# EAGLE design DoubleWing_Blank (EAGLE 9.4.2)
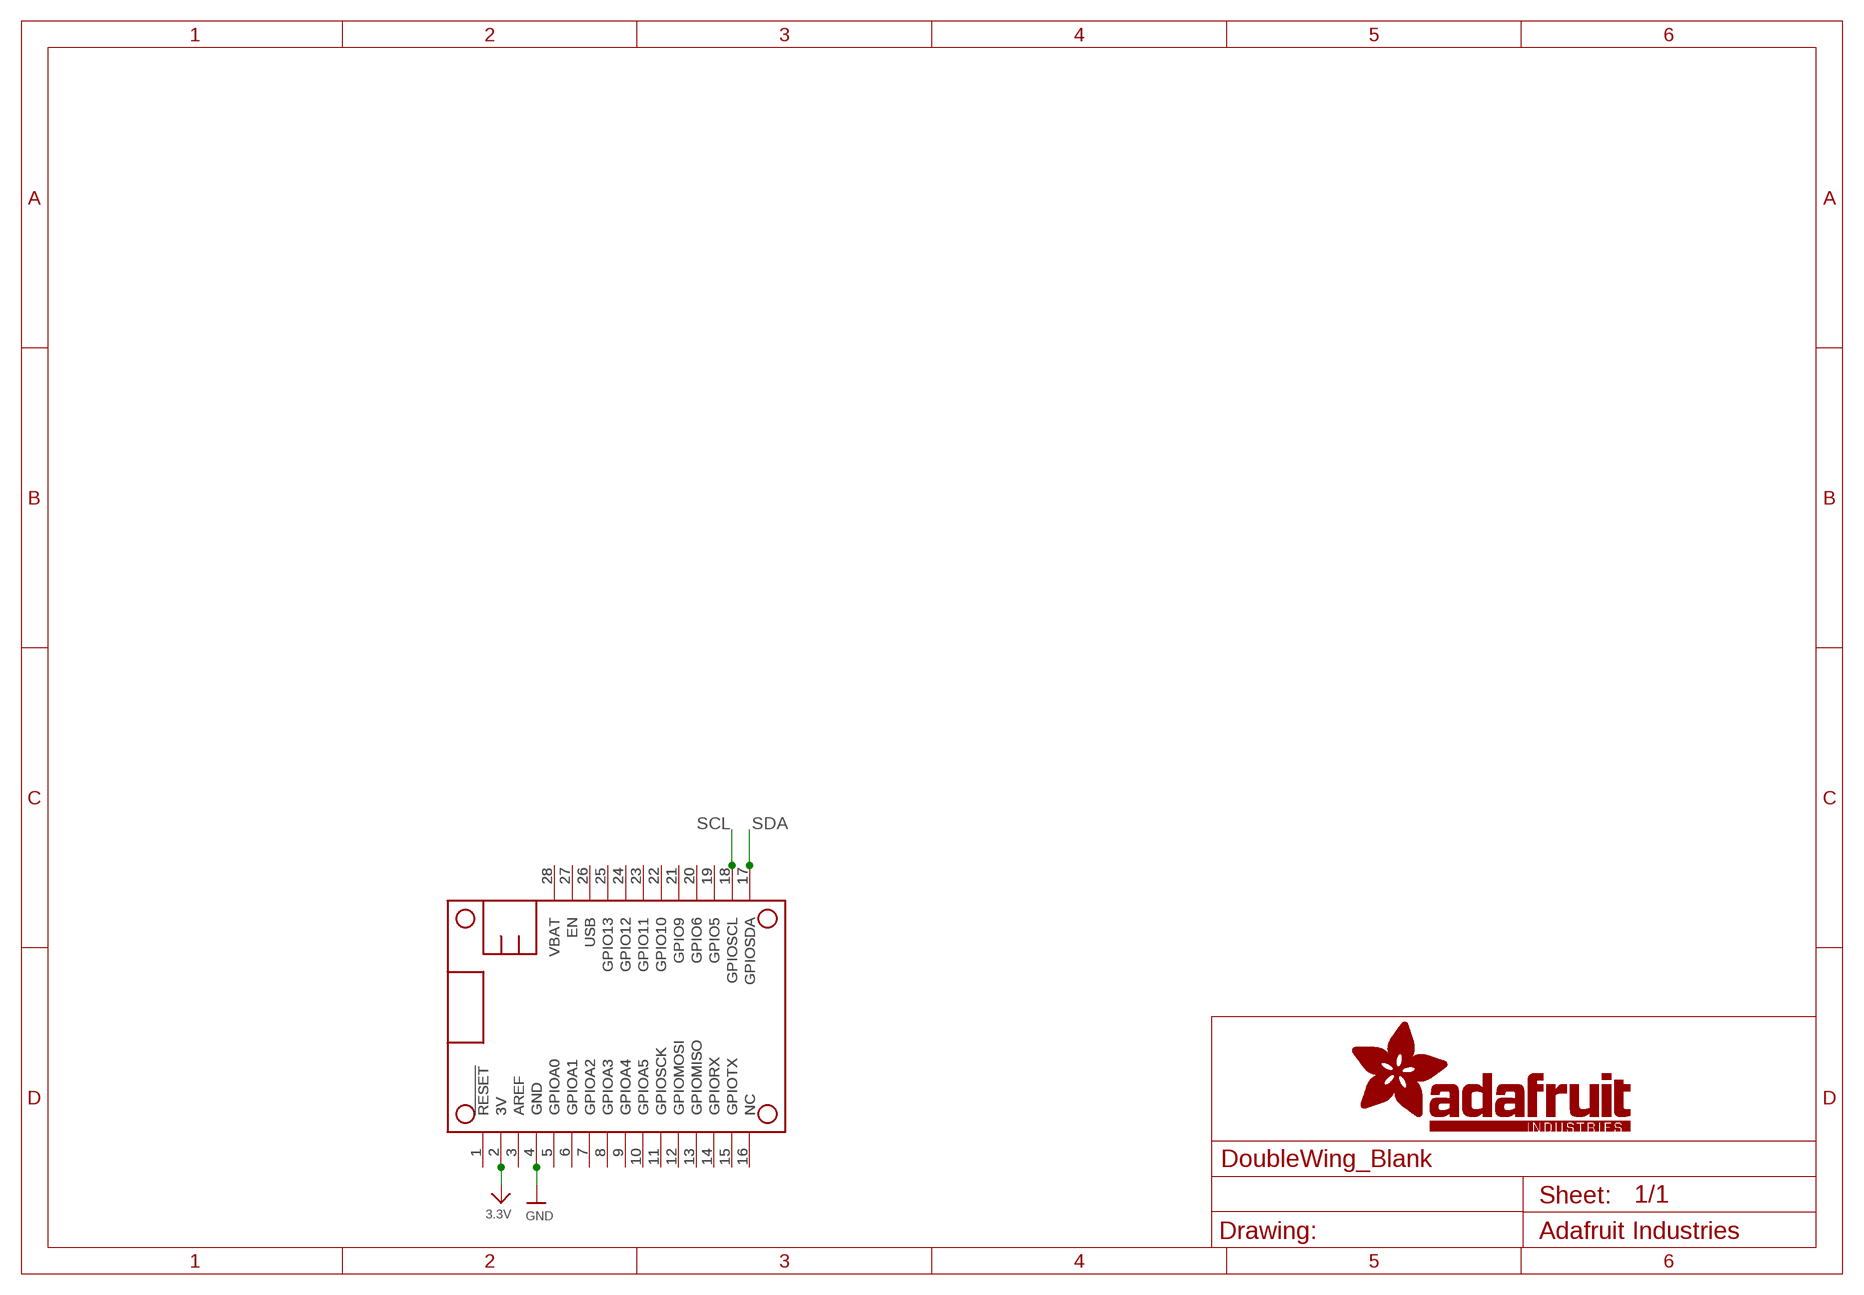
[diagram p0: schematic, sheet 1]

## Parts
MS1  FEATHERWING_NODIM  [FEATHERWING_DIM]
MS2  FEATHERWING_NODIM  [FEATHERWING_DIM]

## Nets
3.3V: MS1.2(3V) MS2.2(3V)
GND: MS1.4(GND) MS2.4(GND)
N$1: MS1.27(EN) MS2.27(EN)
N$2: MS1.16(NC) MS2.16(NC)
N$3: MS1.25(GPIO13) MS2.25(GPIO13)
N$4: MS1.15(GPIOTX) MS2.15(GPIOTX)
N$5: MS1.24(GPIO12) MS2.24(GPIO12)
N$6: MS1.14(GPIORX) MS2.14(GPIORX)
N$7: MS1.13(GPIOMISO) MS2.13(GPIOMISO)
N$8: MS1.12(GPIOMOSI) MS2.12(GPIOMOSI)
N$9: MS1.11(GPIOSCK) MS2.11(GPIOSCK)
N$10: MS1.10(GPIOA5) MS2.10(GPIOA5)
N$11: MS1.9(GPIOA4) MS2.9(GPIOA4)
N$12: MS1.8(GPIOA3) MS2.8(GPIOA3)
N$13: MS1.7(GPIOA2) MS2.7(GPIOA2)
N$14: MS1.6(GPIOA1) MS2.6(GPIOA1)
N$15: MS1.5(GPIOA0) MS2.5(GPIOA0)
N$17: MS1.3(AREF) MS2.3(AREF)
N$18: MS1.1(!RESET) MS2.1(!RESET)
N$19: MS1.23(GPIO11) MS2.23(GPIO11)
N$20: MS1.22(GPIO10) MS2.22(GPIO10)
N$21: MS1.21(GPIO9) MS2.21(GPIO9)
N$22: MS1.20(GPIO6) MS2.20(GPIO6)
N$23: MS1.19(GPIO5) MS2.19(GPIO5)
SCL: MS1.18(GPIOSCL) MS2.18(GPIOSCL)
SDA: MS1.17(GPIOSDA) MS2.17(GPIOSDA)
USB: MS1.26(USB) MS2.26(USB)
VBAT: MS1.28(VBAT) MS2.28(VBAT)

## Library data of the parts
MS1 MS2 = microbuilder:FEATHERWING

## Board
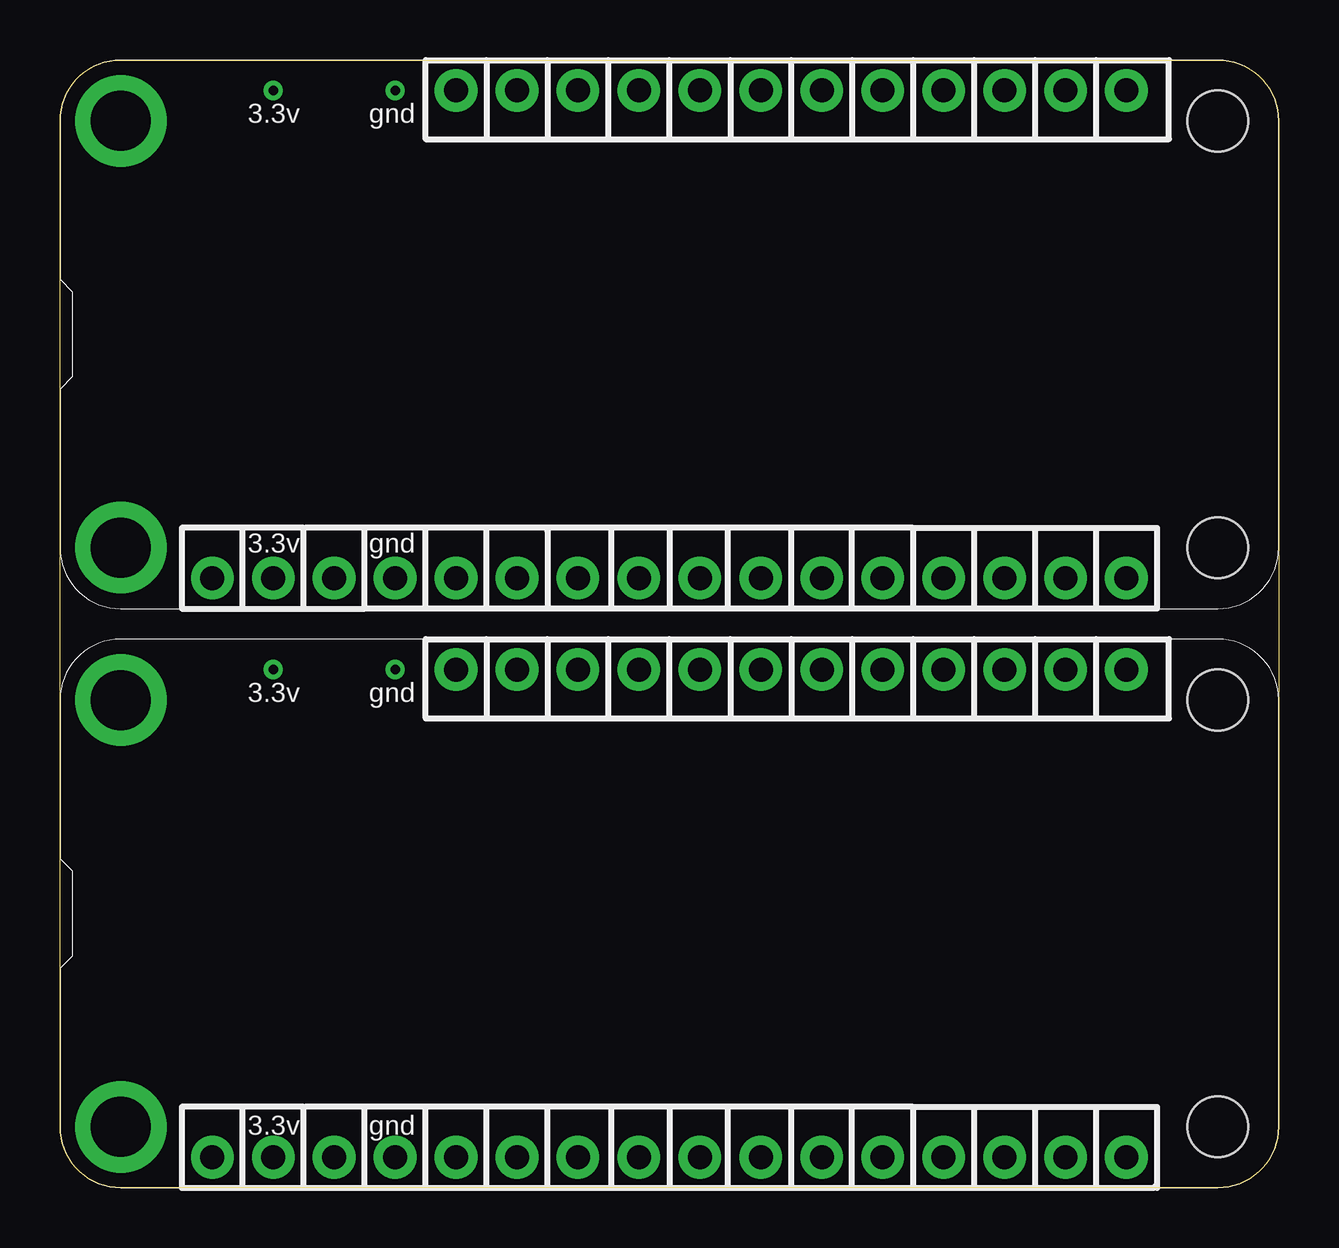
[diagram p1: board, top side]
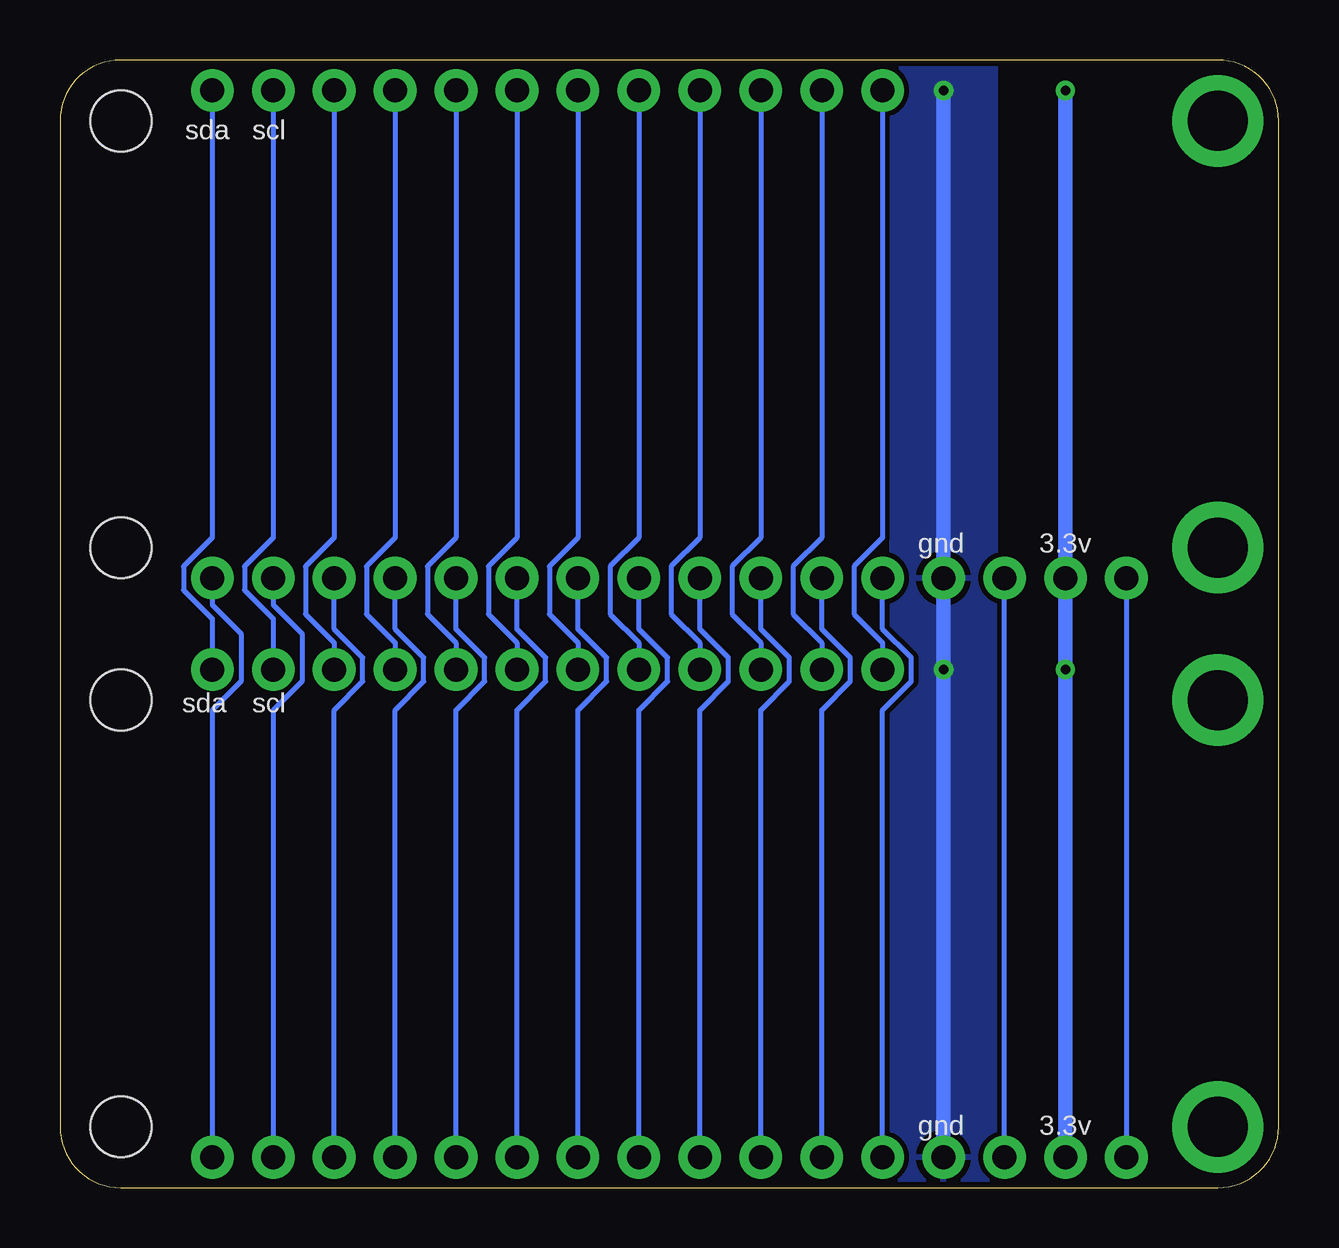
[diagram p2: board, bottom side, seen from below]

Size 50.8 x 46.99 mm. Coordinates in mm from the lower left corner, seen from the top.
Outline: 2.54,46.99 48.26,46.99 arc-90 50.8,44.45 50.8,2.54 arc-90 48.26,0 2.54,0 arc-90 0,2.54 0,44.45 arc-90 2.54,46.99
Copper layers (1*16): Top 0.035mm / dielectric 1.5mm / Bottom 0.035mm
Design rules "adafruit": minimum track width 8mil, minimum drill 15.5mil, track to track 8mil, track to pad 8mil, pad to pad 8mil, via to via 8mil, smd to smd 8mil, copper to edge 10mil, drill to drill 8mil, minimum pad ring 10mil, minimum via ring 8mil, stop-mask expansion 2mil, vias tented up to drill 20mil, thermal gap 10mil

### Footprints (pad centres in the part's own frame; a part is rotated, then mirrored left to right if it is on the bottom)
FEATHERWING_DIM = drill 1 pad 1.778: 1 6.35,1.27; 2 8.89,1.27; 3 11.43,1.27; 4 13.97,1.27; 5 16.51,1.27; 6 19.05,1.27; 7 21.59,1.27; 8 24.13,1.27; 9 26.67,1.27; 10 29.21,1.27; 11 31.75,1.27; 12 34.29,1.27; 13 36.83,1.27; 14 39.37,1.27; 15 41.91,1.27; 16 44.45,1.27; 17 44.45,21.59; 18 41.91,21.59; 19 39.37,21.59; 20 36.83,21.59; 21 34.29,21.59; 22 31.75,21.59; 23 29.21,21.59; 24 26.67,21.59; 25 24.13,21.59; 26 21.59,21.59; 27 19.05,21.59; 28 16.51,21.59 | drill 2.5 pad 3.81: P$1 2.54,20.32; P$2 2.54,2.54 | hole 2.54: 48.26,20.32; 48.26,2.54

### Placement (x,y rotation side)
MS1  0,0 0 top
MS2  0,24.13 0 top

### Tracks (layer width: path | path; a pad name or v marks a point on that pad's centre or on a via)
3.3V  (via drill 0.39)
  Bottom 0.61: v8.89,45.72 MS2.2 v8.89,21.59 MS1.2
GND  (via drill 0.39)
  Bottom 0.61: v13.97,45.72 MS2.4 v13.97,21.59 MS1.4
  pour Bottom: 16.13,46.74 11.81,46.74 11.81,0.25 16.13,0.25
N$1
  Bottom 0.203: MS1.27 19.05,22.7 20.24,23.9 20.24,25.89 19.05,27.09 MS2.27
N$2
  Bottom 0.203: MS2.16 44.45,24.29 43.26,23.09 43.26,21.1 44.45,19.9 MS1.16
N$3
  Bottom 0.203: MS1.25 24.13,22.7 25.32,23.9 25.32,25.89 24.13,27.09 MS2.25
N$4
  Bottom 0.203: MS2.15 41.91,24.29 40.72,23.09 40.72,21.1 41.91,19.9 MS1.15
N$5
  Bottom 0.203: MS1.24 26.67,22.7 27.86,23.9 27.86,25.89 26.67,27.09 MS2.24
N$6
  Bottom 0.203: MS1.14 39.37,19.9 38.18,21.1 38.18,22.08 39.37,23.28 MS2.14
N$7
  Bottom 0.203: MS1.13 36.83,19.9 35.64,21.1 35.64,22.08 36.83,23.28 MS2.13
N$8
  Bottom 0.203: MS1.12 34.29,19.9 33.1,21.1 33.1,22.08 34.29,23.28 MS2.12
N$9
  Bottom 0.203: MS1.11 31.75,19.9 30.56,21.1 30.56,22.08 31.75,23.28 MS2.11
N$10
  Bottom 0.203: MS1.10 29.21,19.9 28.02,21.1 28.02,22.08 29.21,23.28 MS2.10
N$11
  Bottom 0.203: MS1.9 26.67,19.9 25.48,21.1 25.48,22.08 26.67,23.28 MS2.9
N$12
  Bottom 0.203: MS1.8 24.13,19.9 22.94,21.1 22.94,22.08 24.13,23.28 MS2.8
N$13
  Bottom 0.203: MS1.7 21.59,19.9 20.4,21.1 20.4,22.08 21.59,23.28 MS2.7
N$14
  Bottom 0.203: MS1.6 19.05,19.9 17.86,21.1 17.86,22.08 19.05,23.28 MS2.6
N$15
  Bottom 0.203: MS1.5 16.51,19.9 15.32,21.1 15.32,22.08 16.51,23.28 MS2.5
N$17
  Bottom 0.203: MS1.3 MS2.3
N$18
  Bottom 0.203: MS2.1 MS1.1
N$19
  Bottom 0.203: MS1.23 29.21,22.7 30.4,23.9 30.4,25.89 29.21,27.09 MS2.23
N$20
  Bottom 0.203: MS1.22 31.75,22.7 32.94,23.9 32.94,25.89 31.75,27.09 MS2.22
N$21
  Bottom 0.203: MS1.21 34.29,22.7 35.48,23.9 35.48,25.89 34.29,27.09 MS2.21
N$22
  Bottom 0.203: MS1.20 36.83,22.7 38.02,23.9 38.02,25.89 36.83,27.09 MS2.20
N$23
  Bottom 0.203: MS1.19 39.37,22.7 40.56,23.9 40.56,25.89 39.37,27.09 MS2.19
SCL
  Bottom 0.203: MS2.18 41.91,27.09 43.1,25.89 43.1,24.91 41.91,23.71 MS1.18
SDA
  Bottom 0.203: MS1.17 44.45,23.71 45.64,24.91 45.64,25.89 44.45,27.09 MS2.17
USB
  Bottom 0.203: MS1.26 21.59,22.7 22.78,23.9 22.78,25.89 21.59,27.09 MS2.26
VBAT
  Bottom 0.203: MS1.28 16.51,22.7 17.7,23.9 17.7,25.89 16.51,27.09 MS2.28

### Text on the board
tPlace: 3.3v | gnd | 3.3v | gnd | 3.3v | gnd | 3.3v | gnd
bPlace: scl | sda | 3.3v | gnd | scl | sda | 3.3v | gnd